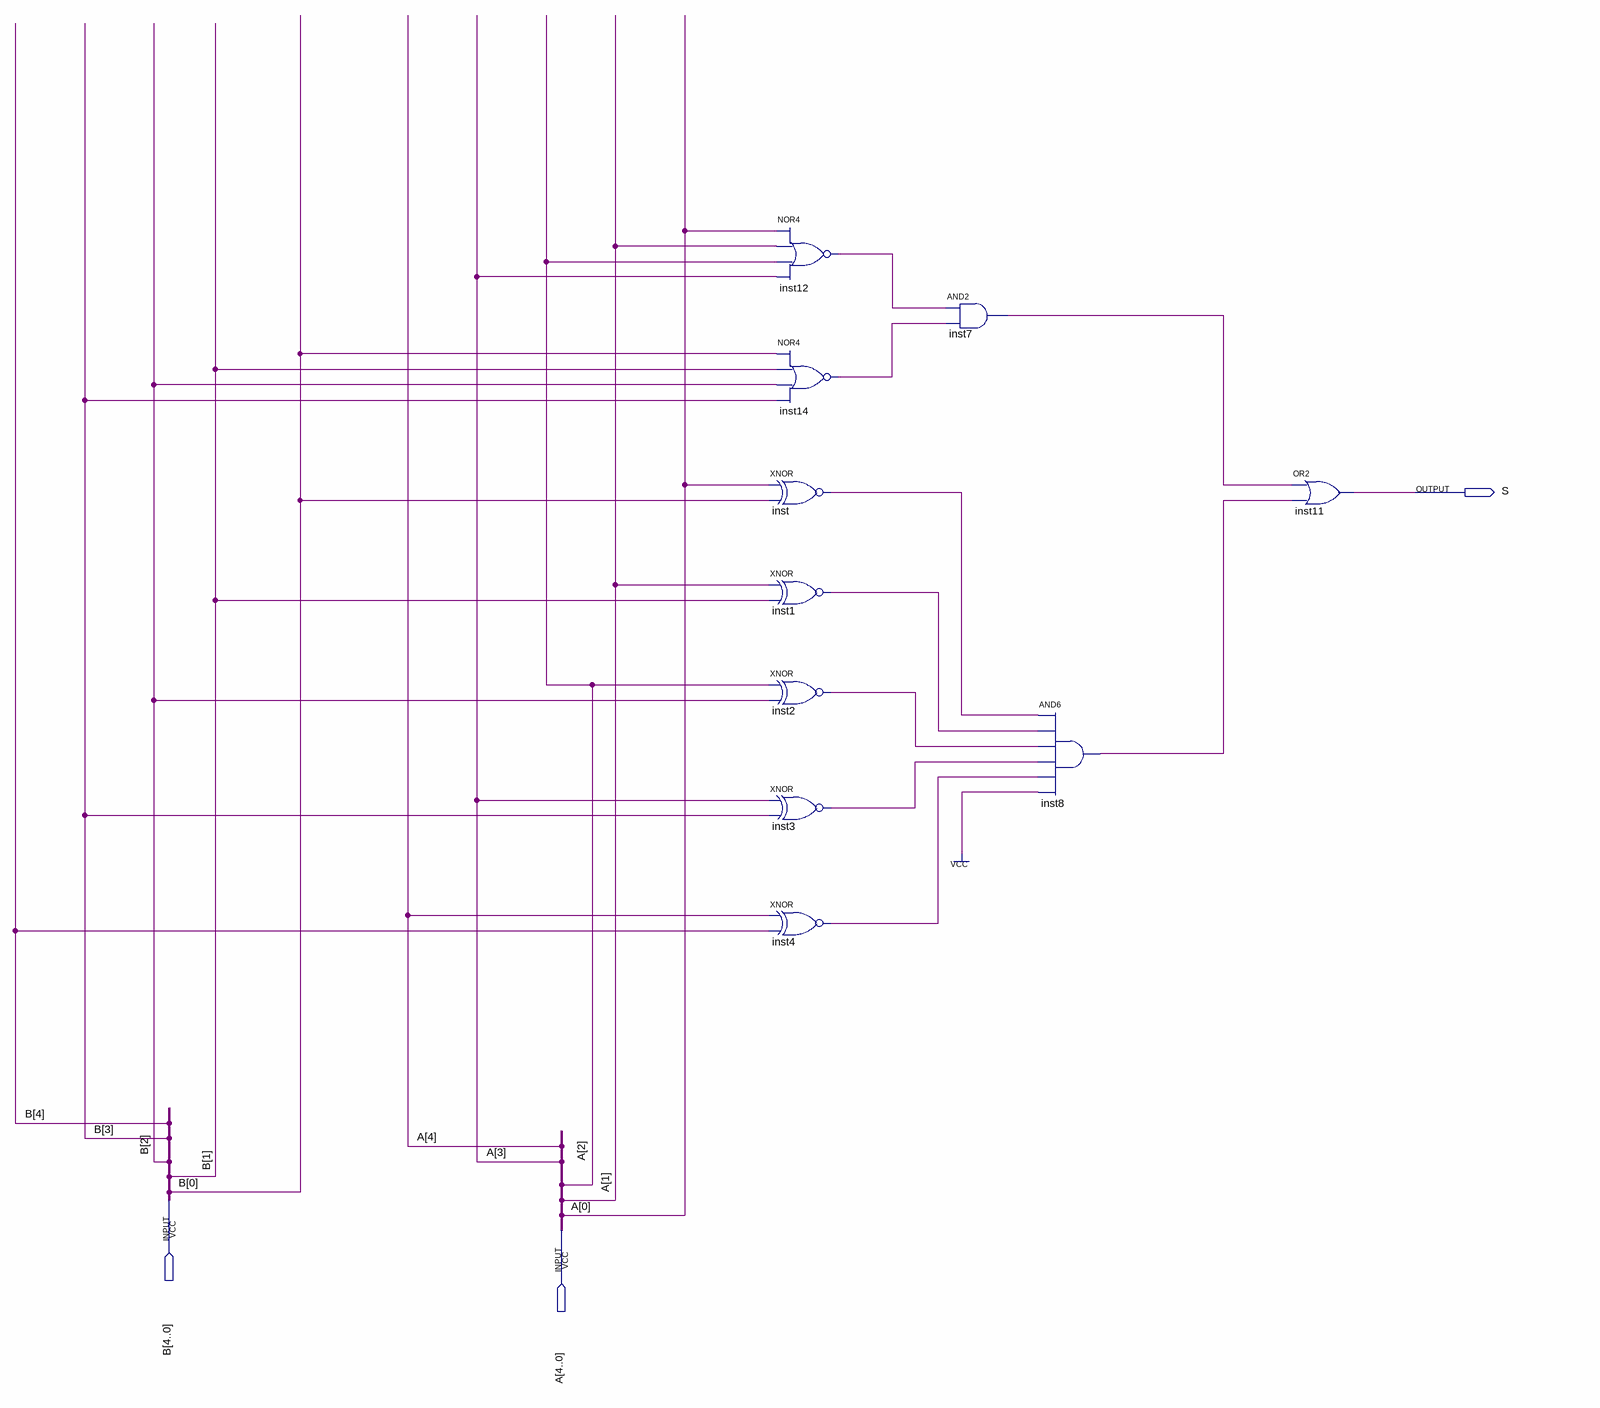
[diagram p0: schematic sheet]
// Quartus schematic aigualb.bdf as structural Verilog: 10 symbols, 3 pins
module aigualb (
  input  [4:0] B,
  input  [4:0] A,
  output S
);

  wire inst1_out, inst2_out, inst3_out, inst4_out, inst7_out, inst8_out, inst12_out, inst14_out, inst_out;

  nor inst12 (inst12_out, A[0], A[1], A[2], A[3]);
  nor inst14 (inst14_out, B[0], B[1], B[2], B[3]);
  xnor inst (inst_out, A[0], B[0]);
  xnor inst1 (inst1_out, A[1], B[1]);
  xnor inst2 (inst2_out, A[2], B[2]);
  xnor inst3 (inst3_out, A[3], B[3]);
  xnor inst4 (inst4_out, A[4], B[4]);
  and inst7 (inst7_out, inst12_out, inst14_out);
  and inst8 (inst8_out, inst_out, inst1_out, inst2_out, inst3_out, inst4_out, 1'b1);
  or inst11 (S, inst7_out, inst8_out);
endmodule
